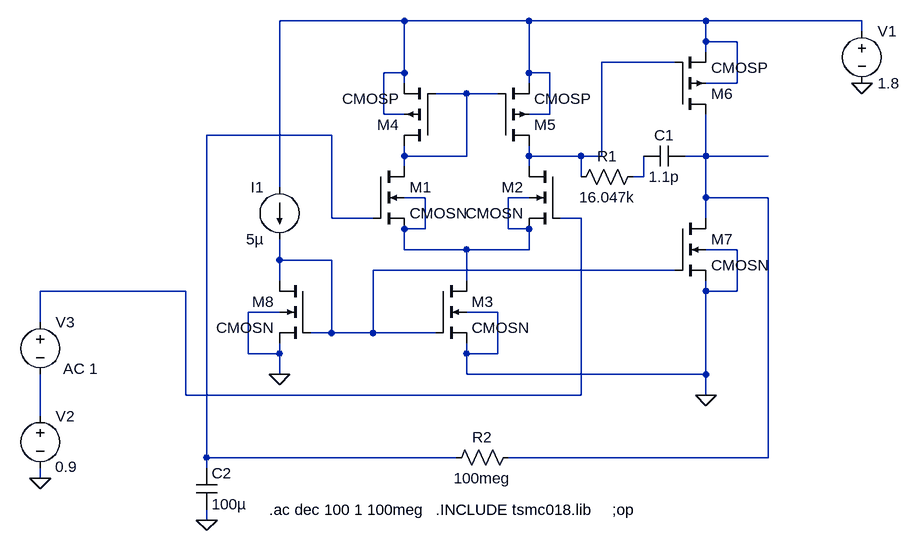
[diagram p0: schematic 2-stageOpamp_openloop.asc]
2-stageOpamp_openloop.asc, the LTspice schematic file:
Version 4
SHEET 1 880 680
WIRE -256 -672 -448 -672
WIRE -64 -672 -256 -672
WIRE 208 -672 -64 -672
WIRE 448 -672 208 -672
WIRE 448 -656 448 -672
WIRE 208 -640 208 -672
WIRE 256 -640 208 -640
WIRE 208 -624 208 -640
WIRE 160 -608 48 -608
WIRE -256 -592 -256 -672
WIRE -256 -592 -288 -592
WIRE -64 -592 -64 -672
WIRE -32 -592 -64 -592
WIRE -256 -576 -256 -592
WIRE -64 -576 -64 -592
WIRE 256 -576 256 -640
WIRE 256 -576 208 -576
WIRE -160 -560 -208 -560
WIRE -112 -560 -160 -560
WIRE -288 -528 -288 -592
WIRE -256 -528 -288 -528
WIRE -32 -528 -32 -592
WIRE -32 -528 -64 -528
WIRE -368 -496 -560 -496
WIRE -256 -464 -256 -480
WIRE -160 -464 -160 -560
WIRE -160 -464 -256 -464
WIRE -64 -464 -64 -480
WIRE 16 -464 -64 -464
WIRE 48 -464 48 -608
WIRE 48 -464 16 -464
WIRE 208 -464 208 -528
WIRE 208 -464 176 -464
WIRE 304 -464 208 -464
WIRE -256 -448 -256 -464
WIRE -64 -448 -64 -464
WIRE 16 -432 16 -464
WIRE 112 -432 112 -464
WIRE 112 -432 96 -432
WIRE -448 -416 -448 -672
WIRE -224 -400 -256 -400
WIRE -64 -400 -96 -400
WIRE 208 -400 208 -464
WIRE 304 -400 208 -400
WIRE -368 -368 -368 -496
WIRE -304 -368 -368 -368
WIRE 16 -368 -16 -368
WIRE 208 -368 208 -400
WIRE -224 -352 -224 -400
WIRE -224 -352 -256 -352
WIRE -96 -352 -96 -400
WIRE -64 -352 -96 -352
WIRE -256 -320 -256 -352
WIRE -160 -320 -256 -320
WIRE -64 -320 -64 -352
WIRE -64 -320 -160 -320
WIRE 256 -320 208 -320
WIRE -448 -304 -448 -336
WIRE -368 -304 -448 -304
WIRE 160 -288 -304 -288
WIRE -448 -272 -448 -304
WIRE -160 -272 -160 -320
WIRE -592 -256 -816 -256
WIRE 208 -256 208 -272
WIRE 256 -256 256 -320
WIRE 256 -256 208 -256
WIRE -448 -224 -496 -224
WIRE -112 -224 -160 -224
WIRE -816 -208 -816 -256
WIRE -368 -192 -368 -304
WIRE -368 -192 -400 -192
WIRE -304 -192 -304 -288
WIRE -304 -192 -368 -192
WIRE -208 -192 -304 -192
WIRE -496 -160 -496 -224
WIRE -448 -160 -448 -176
WIRE -448 -160 -496 -160
WIRE -160 -160 -160 -176
WIRE -112 -160 -112 -224
WIRE -112 -160 -160 -160
WIRE -448 -128 -448 -160
WIRE -160 -128 -160 -160
WIRE 208 -128 208 -256
WIRE 208 -128 -160 -128
WIRE -592 -96 -592 -256
WIRE 16 -96 16 -368
WIRE 16 -96 -592 -96
WIRE 208 -96 208 -128
WIRE -816 -64 -816 -128
WIRE -560 0 -560 -496
WIRE -176 0 -560 0
WIRE 304 0 304 -400
WIRE 304 0 -96 0
WIRE -560 16 -560 0
WIRE -816 32 -816 16
WIRE -560 96 -560 80
FLAG 208 -96 0
FLAG -448 -128 0
FLAG 448 -576 0
FLAG -816 32 0
FLAG -560 96 0
SYMBOL cmosn -304 -448 R0
SYMATTR InstName M1
SYMATTR Value2 l=0.36u w=0.373824u
SYMBOL cmosn -16 -448 M0
SYMATTR InstName M2
SYMATTR Value2 l=0.36u w=0.373824u
SYMBOL cmosn -208 -272 R0
SYMATTR InstName M3
SYMATTR Value2 l=0.36u w=0.39132u
SYMBOL cmosp -208 -480 R180
SYMATTR InstName M4
SYMATTR Value2 l=0.36u w=0.45u
SYMBOL cmosp -112 -480 M180
SYMATTR InstName M5
SYMATTR Value2 l=0.36u w=0.45u
SYMBOL cap 176 -480 R90
WINDOW 0 0 32 VBottom 2
WINDOW 3 32 32 VTop 2
SYMATTR InstName C1
SYMATTR Value 1.1p
SYMBOL cmosp 160 -528 M180
SYMATTR InstName M6
SYMATTR Value2 l=0.36u w=6.22u
SYMBOL cmosn 160 -368 R0
SYMATTR InstName M7
SYMATTR Value2 l=0.36u w=2.7036u
SYMBOL cmosn -400 -272 M0
SYMATTR InstName M8
SYMATTR Value2 l=0.36u w=0.39132u
SYMBOL current -448 -416 M0
WINDOW 123 0 0 Left 2
WINDOW 39 0 0 Left 2
SYMATTR InstName I1
SYMATTR Value 5µ
SYMBOL voltage 448 -672 R0
WINDOW 123 0 0 Left 2
WINDOW 39 0 0 Left 2
SYMATTR InstName V1
SYMATTR Value 1.8
SYMBOL voltage -816 -80 R0
WINDOW 123 24 124 Left 2
WINDOW 39 0 0 Left 2
WINDOW 3 23 94 Left 2
SYMATTR Value 0.9
SYMATTR InstName V2
SYMBOL res 112 -448 R90
WINDOW 0 0 56 VBottom 2
WINDOW 3 32 56 VTop 2
SYMATTR InstName R1
SYMATTR Value 16.047k
SYMBOL voltage -816 -224 R0
WINDOW 3 24 44 Left 2
WINDOW 123 35 87 Left 2
WINDOW 39 0 0 Left 2
SYMATTR Value ""
SYMATTR Value2 AC 1
SYMATTR InstName V3
SYMBOL cap -576 16 R0
SYMATTR InstName C2
SYMATTR Value 100µ
SYMBOL res -80 -16 R90
WINDOW 0 0 56 VBottom 2
WINDOW 3 32 56 VTop 2
SYMATTR InstName R2
SYMATTR Value 100meg
TEXT -208 80 Left 2 !.INCLUDE tsmc018.lib
TEXT 64 80 Left 2 !;op
TEXT -464 80 Left 2 !.ac dec 100 1 100meg

The netlist it stands for:
* 2-stageOpamp_openloop.asc
M1 N003 N004 N007 N007 CMOSN l=0.36u w=0.373824u
M2 N002 N008 N007 N007 CMOSN l=0.36u w=0.373824u
M3 N007 N009 0 0 CMOSN l=0.36u w=0.39132u
M4 N003 N003 N001 N001 CMOSP l=0.36u w=0.45u
M5 N002 N003 N001 N001 CMOSP l=0.36u w=0.45u
C1 N005 N006 1.1p
M6 N005 N002 N001 N001 CMOSP l=0.36u w=6.22u
M7 N005 N009 0 0 CMOSN l=0.36u w=2.7036u
M8 N009 N009 0 0 CMOSN l=0.36u w=0.39132u
I1 N001 N009 5µ
V1 N001 0 1.8
V2 N010 0 0.9
R1 N006 N002 16.047k
V3 N008 N010 AC 1
C2 N004 0 100µ
R2 N005 N004 100meg
.model NMOS NMOS
.model PMOS PMOS
.lib standard.mos
.INCLUDE tsmc018.lib
;op
.ac dec 100 1 100meg
.backanno
.end